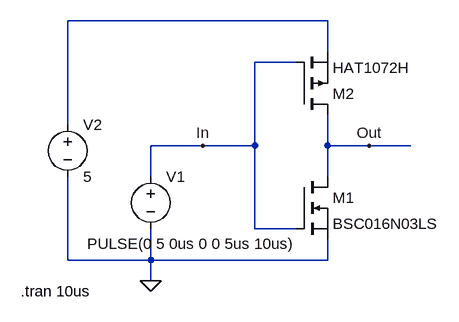
[diagram p0: schematic NonIdealInverter.asc]
NonIdealInverter.asc, the LTspice schematic file:
Version 4
SHEET 1 880 680
WIRE 32 -48 -368 -48
WIRE 32 0 32 -48
WIRE -16 16 -80 16
WIRE -368 112 -368 -48
WIRE -160 144 -240 144
WIRE -80 144 -80 16
WIRE -80 144 -160 144
WIRE 32 144 32 96
WIRE 96 144 32 144
WIRE 160 144 96 144
WIRE -240 192 -240 144
WIRE 32 192 32 144
WIRE -80 272 -80 144
WIRE -16 272 -80 272
WIRE -368 320 -368 192
WIRE -240 320 -240 272
WIRE -240 320 -368 320
WIRE 32 320 32 288
WIRE 32 320 -240 320
WIRE -240 352 -240 320
FLAG -240 352 0
FLAG -160 144 In
FLAG 96 144 Out
SYMBOL nmos -16 192 R0
SYMATTR InstName M1
SYMATTR Value BSC016N03LS
SYMBOL pmos -16 96 M180
SYMATTR InstName M2
SYMATTR Value HAT1072H
SYMBOL voltage -240 176 R0
WINDOW 123 0 0 Left 0
WINDOW 39 0 0 Left 0
WINDOW 3 -98 119 Left 2
SYMATTR InstName V1
SYMATTR Value PULSE(0 5 0us 0 0 5us 10us)
SYMBOL voltage -368 96 R0
WINDOW 123 0 0 Left 0
WINDOW 39 24 124 Left 2
SYMATTR InstName V2
SYMATTR Value 5
TEXT -440 368 Left 2 !.tran 10us

The netlist it stands for:
* NonIdealInverter.asc
M1 Out In 0 0 BSC016N03LS
M2 Out In N001 N001 HAT1072H
V1 In 0 PULSE(0 5 0us 0 0 5us 10us)
V2 N001 0 5
.model NMOS NMOS
.model PMOS PMOS
.lib standard.mos
.tran 10us
.backanno
.end